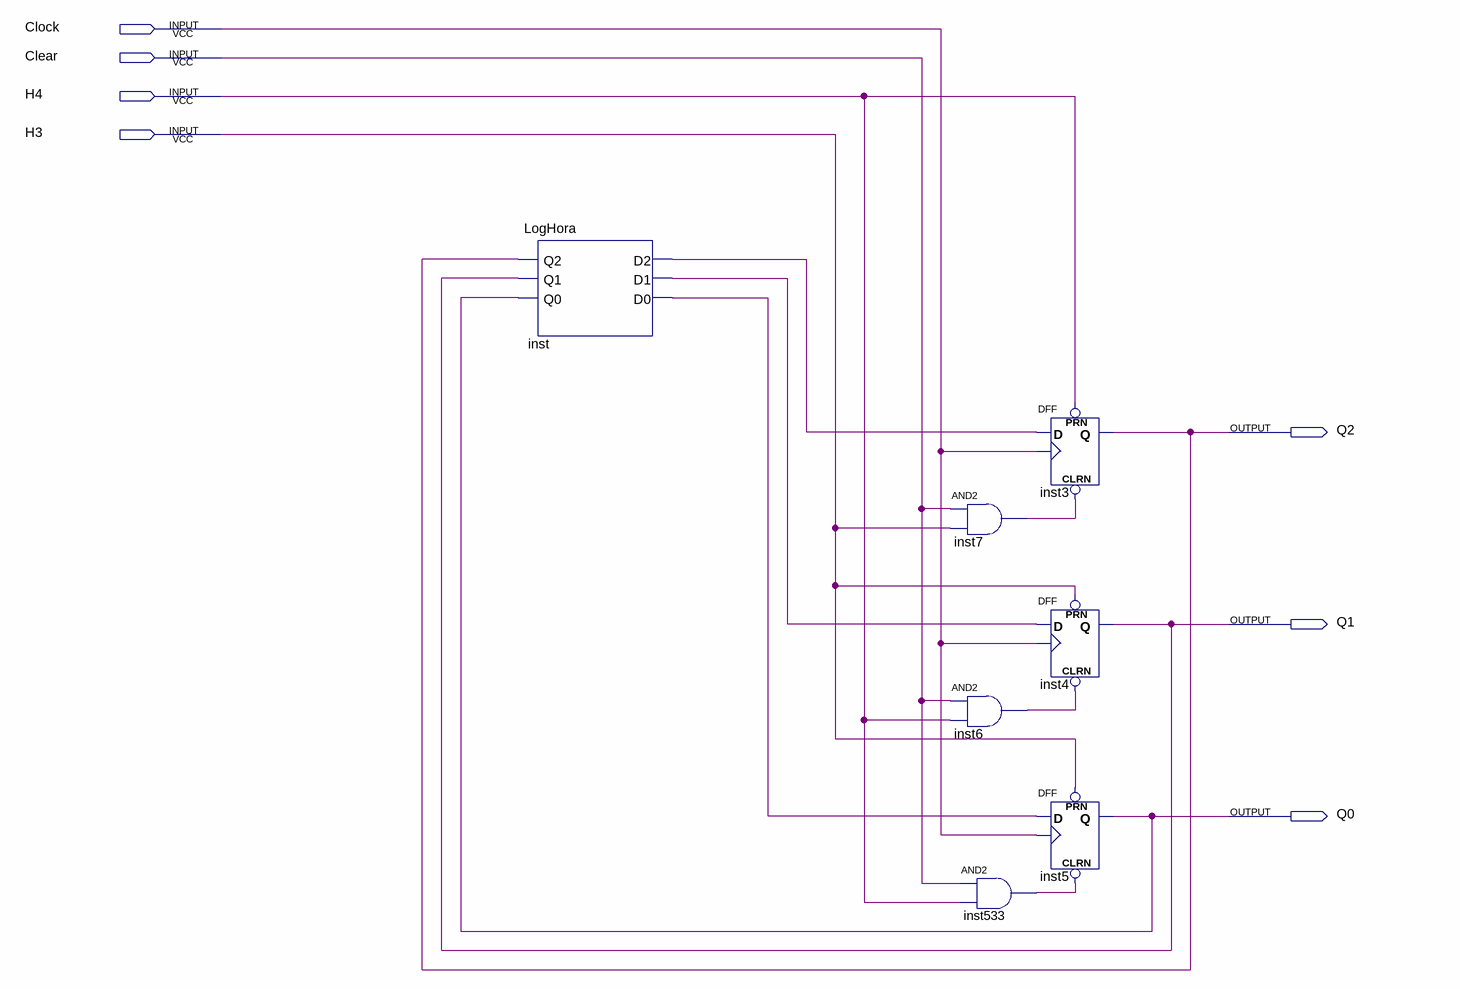
[diagram p0: schematic sheet]
// Quartus schematic ContadorHoras.bdf as structural Verilog: 7 symbols, 7 pins
module ContadorHoras (
  input  Clock,
  input  Clear,
  input  H4,
  input  H3,
  output Q2,
  output Q1,
  output Q0
);

  wire inst6_out, inst7_out, inst533_out, inst_d0, inst_d1, inst_d2;

  LogHora inst (.Q2(Q2), .Q1(Q1), .Q0(Q0), .D2(inst_d2), .D1(inst_d1), .D0(inst_d0));
  and inst7 (inst7_out, Clear, H3);
  and inst6 (inst6_out, Clear, H4);
  and inst533 (inst533_out, Clear, H4);
  DFF inst3 (.CLRN(inst7_out), .CLK(Clock), .D(inst_d2), .PRN(H4), .Q(Q2));
  DFF inst4 (.CLRN(inst6_out), .CLK(Clock), .D(inst_d1), .PRN(H3), .Q(Q1));
  DFF inst5 (.CLRN(inst533_out), .CLK(Clock), .D(inst_d0), .PRN(H3), .Q(Q0));
endmodule
